# Altium project RFID.PrjPcb
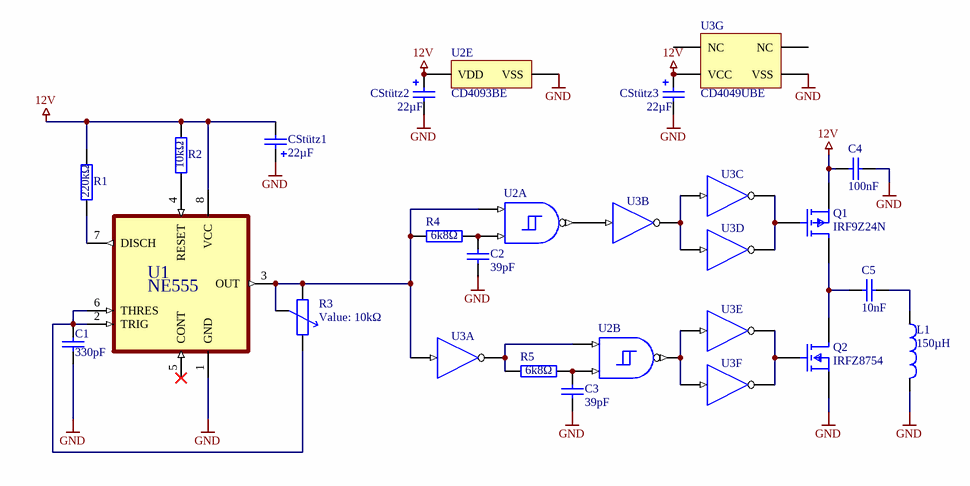
[diagram p0: Lesegerät.SchDoc]
10 sheets, 213 parts. Net scope: flat (ports and power ports of the same name join across sheets).
Sheets:
  Lesegerät.SchDoc
  Lesegerät_RC-Ozillator.SchDoc
  Lesegerät_SigA_MosT_GegE.SchDoc
  Tag.SchDoc
  Lesegerät_Lastmodulation_Sekundär.SchDoc
  Tag_Lastmodulation_Sekundär.SchDoc
  Lesegerät_Lastmodulation_Primär.SchDoc
  Tag_Lastmodulation_Primär.SchDoc
  Lesegerät_Lastmodulation_ESP32.SchDoc
  Tag_Lastmodulation_ESP32.SchDoc

## Sheet Lesegerät.SchDoc
size A4; SheetNumber: 1; SheetTotal: 9; PageSetup: Record=PageOptions|CenterHorizontal=True|CenterVertical=True|PrintScale=0.97|XCorrection=1.00|YCorrection=1.00|PrintKind=2|BorderSize=5000000|LeftOffset=0|BottomOffset=0|Orientation=2|PaperLength=1000|PaperWidth=1000|Scale=100|PaperSource=7|PrintQuality=-3|MediaType=1|DitherType=10|PrintScaleMode=1|PaperKind=A4|PaperIndex=9

### Parts
(Parts that share a designator on the sheet are numbered #1, #2 ... from top to bottom, then left to right.)
C1#1  330pF  [rad-7.2/2.5/5]
C2#1  value 39pF  [rad-7.2/2.5/5]  (hidden comment: KO)
C3#1  value 39pF  [rad-7.2/2.5/5]  (hidden comment: KO)
C4#1  value 100nF  [rad-7.2/2.5/5]  (hidden comment: KO)
C5#1  value 10nF  [rad-7.2/2.5/5]  (hidden comment: KO)
CStütz1#1  value 22µF  [RB-.1/.2]  (hidden comment: ELKO)
CStütz2#1  value 22µF  [RB-.1/.2]  (hidden comment: ELKO)
CStütz3#1  value 22µF  [RB-.1/.2]  (hidden comment: ELKO)
L1#1  value 150µH  (hidden comment: Inductor)
Q1#1  IRF9Z24N  [FP-PG-SOT323-3-IPC_A]
Q2#1  IRFZ8754  [FP-SOT23-IPC_A]
R1#1  value 220kΩ  [Axial-0.4]  (hidden comment: RES)
R2#1  value 10kΩ  [Axial-0.4]  (hidden comment: RES)
R3#1  value 10kΩ  [PT15]  (hidden comment: POT)
R4#1  value 6k8Ω  [Axial-0.4]  (hidden comment: RES)
R5#1  value 6k8Ω  [Axial-0.4]  (hidden comment: RES)
U1#1  NE555  [DIP794W45P254L959H508Q8]
U2#1  CD4093BE  [N0014A]  (value not drawn)  (parts A,B,E of 5)
U3#1  CD4049UBE  [N0016A]  (value not drawn)  (parts A,B,C,D,E,F,G of 7)

### Nets
12V: C4#1.1 CStütz1#1.2 CStütz2#1.1 CStütz3#1.1 Q1#1.2(S) R1#1.2 R2#1.2 U1#1.8(VCC) U2#1.14(VDD) U3#1.1(VCC)
GND: C1#1.2 C2#1.2 C3#1.2 C4#1.2 CStütz1#1.1 CStütz2#1.2 CStütz3#1.2 L1#1.2 Q2#1.2(S) U1#1.1(GND) U2#1.7(VSS) U3#1.8(VSS)
NetC1#1_1: C1#1.1 R3#1.2 U1#1.2(TRIG) U1#1.6(THRES)
NetC2#1_1: C2#1.1 R4#1.2 U2#1.2(B)
NetC3#1_1: C3#1.1 R5#1.2 U2#1.6(D)
NetC5#1_1: C5#1.1 Q1#1.3(D) Q2#1.3(D)
NetC5#1_2: C5#1.2 L1#1.1
NetQ1#1_G2: Q1#1.G2(G) U3#1.6(I=~{C}) U3#1.10(J=~{D})
NetQ2#1_G1: Q2#1.G1(G) U3#1.12(K=~{E}) U3#1.15(L=~{F})
NetR1#1_1: R1#1.1 U1#1.7(DISCH)
NetR2#1_1: R2#1.1 U1#1.4(RESET)
NetR3#1_1: R3#1.1 R3#1.3 R4#1.1 U1#1.3(OUT) U2#1.1(A) U3#1.3(A)
NetR5#1_1: R5#1.1 U2#1.5(C) U3#1.2(G=~{A})
NetU2#1_3: U2#1.3(J) U3#1.5(B)
NetU2#1_4: U2#1.4(K) U3#1.11(E) U3#1.14(F)
NetU3#1_4: U3#1.4(H=~{B}) U3#1.7(C) U3#1.9(D)

Not connected (* = marked no-connect by the designer): U1#1 5(CONT)*; U3#1 13(NC) 16(NC)

### Library data of the parts
C1#1 C2#1 C3#1 C4#1 C5#1 = KO: Kondensator
L1#1 = Inductor: SimulationGenericComponent: True
Q1#1 = CMP-32901-000121-1: MOSFET P-CH 60V 150MA SOT-323; Manufacturer: Infineon; Manufacturer Part Number: BSS84PWH6327XTSA1; Automotive Grade: Grade 0; Turn On Delay Time: 6.7ns; Input Capacitace At Vds: 15.3pF @ -25V; Continuous Drain Current: -0.15A; Transconductance: 0.16S; Depletion Mode: False; Max Forward Diode Voltage: -1.12V; Number Of P Channels: 1; Reverse Recovery Charge: 11.6nC; Reverse Recovery Time: 23.6ns; Drain To Source Breakdown Voltage: -60V; Typ Forward Diode Voltage: -0.84V; Threshold Vgs Max: -2V; Turn Off Delay Time: 8.6ns; Gate Charge At Vgs: 1nC @ -10V; Power Dissipation: 0.3W; Pulse Drain Current: -0.6A; Max Junction Temp: +150°C; Gate To Source Voltage: 20V; Rthja Max: 420K/W; Drain To Source Resistance: 6.9Ω; Threshold Vgs Min: -1V; Footprint Url: https://www.infineon.com/cms/en/product/packages/PG-SOT323/PG-SOT323-3-2/; ComponentLink2URL: https://www.infineon.com/dgdl/Infineon-BSS84PW-DS-v02_00-EN.pdf?fileId=db3a3043321e49940132482056d32474; Temperature Range Low: -55°C; Temperature: -55°C to +150°C; Octopart: https://octopart.com/bss84pwh6327xtsa1-infineon-22361355; Category: Trans; Height: 1mm; Lead Free: Yes; Ipc Land Pattern Name: SOT65P210X90-3; Automotive: Yes; Number Of Channels: 1; Digikey Description: MOSFET P-CH 60V 150MA SOT-323; ComponentLink2Description: Datasheet; Device Class L2: Transistors; Drain To Source Voltage: -60V; Temperature Range High: +150°C; Device Class L1: Discrete Semiconductors; RoHS: TRUE; Mouser Description: MOSFET P-Ch -60V 150mA SOT-323-3; Device Class L3: MOSFETs; Package: PG-SOT323-3
Q2#1 = CMP-12801-000064-2: MOSFET N-CH 60V .15MA SOT23-3; On-State Resistance: 5R; Continuous Drain Current (ID): 150mA; Threshold Voltage: 3V; Number of Channels: 1; Gate to Source Voltage (Vgs): 20V; Turn-On Delay Time: 10ns; Power Dissipation: 330mW; Element Configuration: Single; Input Capacitance: 60pF; Weight: 0.000282oz; Height: 1mm; Max Operating Temperature: 150°C; Dual Supply Voltage: 60V; Termination: SMD/SMT; Number of Pins: 3; Number of Elements: 1; Mount: Surface Mount; Min Operating Temperature: -55°C; Nominal Vgs: 3V; Width: 1.4mm; Drain to Source Breakdown Voltage: 60V; Turn-Off Delay Time: 10ns; Case/Package: SOT-23; REACH SVHC: No SVHC; Packaging: Tape and Reel; Length: 3.05mm; Max Power Dissipation: 330mW; Rds On Max: 5R; Lead Free: Lead Free; Contact Plating: Tin; Drain to Source Resistance: 5R; Drain to Source Voltage (Vdss): 60V; Package Quantity: 3000; Current Rating: 150mA; Voltage Rating (DC): 60V
R1#1 R2#1 R4#1 R5#1 = RES: Widerstand
R3#1 = POT: Potentiometer; Set Position: 0.5
U1#1 = NE555P: Single Precision Timer; MF: Texas; SnapEDA_Link: https://www.snapeda.com/parts/NE555P/Texas+Instruments/view-part/?ref=snap; Package: PDIP-8 Texas; Value: *; MP: NE555P; Check_prices: https://www.snapeda.com/parts/NE555P/Texas+Instruments/view-part/?ref=eda
U2#1 = CMP-1627-00493-3: CMOS Quad 2-Input NAND Schmitt Triggers, N0014A, TUBE; Manufacturer: Texas Instruments; ICC @ Nom Voltage(Max)(mA): 0.06; VCC(Min)(V): 3; Rating: Catalog; Bits(#): 4; Technology Family: CD4000; Output Drive (IOL/IOH)(Max)(mA): 1.5/-1.5; VCC(Max)(V): 18; Voltage(Nom)(V): 10; Schmitt Trigger: Yes; F @ Nom Voltage(Max)(Mhz): 8; DatasheetVersion: SCHS115D; PackageReference: N0014A; Code_JEDEC: MS-001; Output Type: CMOS; Input Type: CMOS; Generic Part Number: CD4093B; Operating Temperature Range(C): -55 to 125
U3#1 = CMP-1615-00914-2: CMOS Hex Inverting Buffer/Converter, N0016A, TUBE; Manufacturer: Texas Instruments; Rating: Military; Voltage(Nom)(V): 5; VCC(Min)(V): 3; VCC(Max)(V): 18; Output Drive (IOL/IOH)(Max)(mA): -1.2/5.2; ICC @ Nom Voltage(Max)(mA): 0.03; F @ Nom Voltage(Max)(Mhz): 12; tpd @ Nom Voltage(Max)(ns): 120; Technology Family: CD4000; Schmitt Trigger: No; Bits(#): 6; Code_JEDEC: MS-001; DatasheetVersion: SCHS046I; Generic Part Number: CD4049UB; Input Type: CMOS; Output Type: CMOS; PackageReference: N0016A; Operating Temperature Range(C): -55 to 125

## Sheet Lesegerät_RC-Ozillator.SchDoc
size A4; SheetNumber: 2; SheetTotal: 4
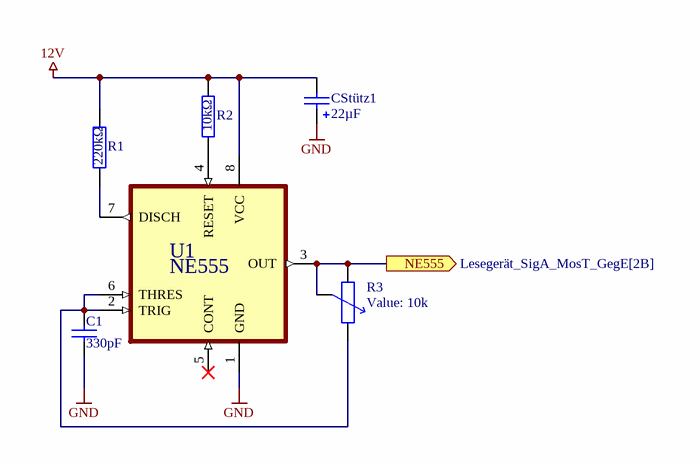
[diagram p1: Lesegerät_RC-Ozillator.SchDoc]

### Parts
(Parts that share a designator on the sheet are numbered #1, #2 ... from top to bottom, then left to right.)
C1#2  330pF  [rad-7.2/2.5/5]
CStütz1#2  value 22µF  [RB-.1/.2]  (hidden comment: ELKO)
R1#2  value 220kΩ  [Axial-0.4]  (hidden comment: RES)
R2#2  value 10kΩ  [Axial-0.4]  (hidden comment: RES)
R3#2  value 10k  [PT15]  (hidden comment: POT)
U1#2  NE555  [DIP794W45P254L959H508Q8]

### Ports
NE555 (out, see Lesegerät_SigA_MosT_GegE[2B])

### Nets
12V: CStütz1#2.2 R1#2.2 R2#2.2 U1#2.8(VCC)
GND: C1#2.2 CStütz1#2.1 U1#2.1(GND)
NetC1#2_1: C1#2.1 R3#2.2 U1#2.2(TRIG) U1#2.6(THRES)
NetR1#2_1: R1#2.1 U1#2.7(DISCH)
NetR2#2_1: R2#2.1 U1#2.4(RESET)
NetR3#2_1: R3#2.1 R3#2.3 U1#2.3(OUT) ; port NE555

Not connected (* = marked no-connect by the designer): U1#2 5(CONT)*

### Library data of the parts
C1#2 = KO: Kondensator
R1#2 R2#2 = RES: Widerstand
R3#2 = POT: Potentiometer; Set Position: 0.5
U1#2 = NE555P: Single Precision Timer; MF: Texas; SnapEDA_Link: https://www.snapeda.com/parts/NE555P/Texas+Instruments/view-part/?ref=snap; Package: PDIP-8 Texas; Value: *; MP: NE555P; Check_prices: https://www.snapeda.com/parts/NE555P/Texas+Instruments/view-part/?ref=eda

## Sheet Lesegerät_SigA_MosT_GegE.SchDoc
size A4; SheetNumber: 3; SheetTotal: 4
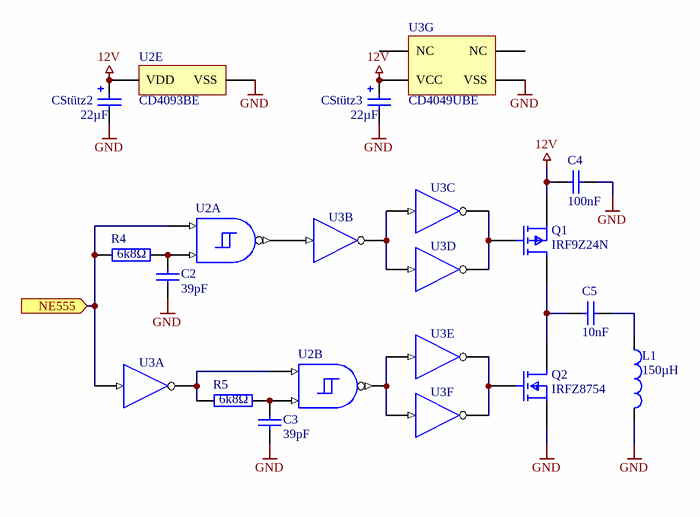
[diagram p2: Lesegerät_SigA_MosT_GegE.SchDoc]

### Parts
(Parts that share a designator on the sheet are numbered #1, #2 ... from top to bottom, then left to right.)
C2#2  value 39pF  [rad-7.2/2.5/5]  (hidden comment: KO)
C3#2  value 39pF  [rad-7.2/2.5/5]  (hidden comment: KO)
C4#2  value 100nF  [rad-7.2/2.5/5]  (hidden comment: KO)
C5#2  value 10nF  [rad-7.2/2.5/5]  (hidden comment: KO)
CStütz2#2  value 22µF  [RB-.1/.2]  (hidden comment: ELKO)
CStütz3#2  value 22µF  [RB-.1/.2]  (hidden comment: ELKO)
L1#2  value 150µH  (hidden comment: Inductor)
Q1#2  IRF9Z24N  [FP-PG-SOT323-3-IPC_A]
Q2#2  IRFZ8754  [FP-SOT23-IPC_A]
R4#2  value 6k8Ω  [Axial-0.4]  (hidden comment: RES)
R5#2  value 6k8Ω  [Axial-0.4]  (hidden comment: RES)
U2#2  CD4093BE  [N0014A]  (value not drawn)  (parts A,B,E of 5)
U3#2  CD4049UBE  [N0016A]  (value not drawn)  (parts A,B,C,D,E,F,G of 7)

### Ports
NE555 (in, see Lesegerät_RC-Ozillator[2B])

### Nets
12V: C4#2.1 CStütz2#2.1 CStütz3#2.1 Q1#2.2(S) U2#2.14(VDD) U3#2.1(VCC)
GND: C2#2.2 C3#2.2 C4#2.2 CStütz2#2.2 CStütz3#2.2 L1#2.2 Q2#2.2(S) U2#2.7(VSS) U3#2.8(VSS)
NetC2#2_1: C2#2.1 R4#2.2 U2#2.2(B)
NetC3#2_1: C3#2.1 R5#2.2 U2#2.6(D)
NetC5#2_1: C5#2.1 Q1#2.3(D) Q2#2.3(D)
NetC5#2_2: C5#2.2 L1#2.1
NetQ1#2_G2: Q1#2.G2(G) U3#2.6(I=~{C}) U3#2.10(J=~{D})
NetQ2#2_G1: Q2#2.G1(G) U3#2.12(K=~{E}) U3#2.15(L=~{F})
NetR3#2_1: R4#2.1 U2#2.1(A) U3#2.3(A) ; port NE555
NetR5#2_1: R5#2.1 U2#2.5(C) U3#2.2(G=~{A})
NetU2#2_3: U2#2.3(J) U3#2.5(B)
NetU2#2_4: U2#2.4(K) U3#2.11(E) U3#2.14(F)
NetU3#2_4: U3#2.4(H=~{B}) U3#2.7(C) U3#2.9(D)

Not connected (* = marked no-connect by the designer): U3#2 13(NC) 16(NC)

### Library data of the parts
C2#2 C3#2 C4#2 C5#2 = KO: Kondensator
L1#2 = Inductor: SimulationGenericComponent: True
Q1#2 = CMP-32901-000121-1: as Q1#1 on sheet Lesegerät; Footprint Url: https://www.infineon.com/cms/en/product/packages/PG-SOT323/PG-SOT323-3-2/; ComponentLink2URL: https://www.infineon.com/dgdl/Infineon-BSS84PW-DS-v02_00-EN.pdf?fileId=db3a3043321e49940132482056d32474; Temperature Range Low: -55°C; Temperature: -55°C to +150°C; Octopart: https://octopart.com/bss84pwh6327xtsa1-infineon-22361355; Category: Trans; Height: 1mm; Lead Free: Yes; Ipc Land Pattern Name: SOT65P210X90-3; Automotive: Yes; Number Of Channels: 1; Digikey Description: MOSFET P-CH 60V 150MA SOT-323; ComponentLink2Description: Datasheet; Device Class L2: Transistors; Drain To Source Voltage: -60V; Temperature Range High: +150°C; Device Class L1: Discrete Semiconductors; RoHS: TRUE; Mouser Description: MOSFET P-Ch -60V 150mA SOT-323-3; Device Class L3: MOSFETs; Package: PG-SOT323-3
Q2#2 = CMP-12801-000064-2: as Q2#1 on sheet Lesegerät; Weight: 0.000282oz; Height: 1mm; Max Operating Temperature: 150°C; Dual Supply Voltage: 60V; Termination: SMD/SMT; Number of Pins: 3; Number of Elements: 1; Mount: Surface Mount; Min Operating Temperature: -55°C; Nominal Vgs: 3V; Width: 1.4mm; Drain to Source Breakdown Voltage: 60V; Turn-Off Delay Time: 10ns; Case/Package: SOT-23; REACH SVHC: No SVHC; Packaging: Tape and Reel; Length: 3.05mm; Max Power Dissipation: 330mW; Rds On Max: 5R; Lead Free: Lead Free; Contact Plating: Tin; Drain to Source Resistance: 5R; Drain to Source Voltage (Vdss): 60V; Package Quantity: 3000; Current Rating: 150mA; Voltage Rating (DC): 60V
R4#2 R5#2 = RES: Widerstand
U2#2 = CMP-1627-00493-3: as U2#1 on sheet Lesegerät; DatasheetVersion: SCHS115D; PackageReference: N0014A; Code_JEDEC: MS-001; Output Type: CMOS; Input Type: CMOS; Generic Part Number: CD4093B; Operating Temperature Range(C): -55 to 125
U3#2 = CMP-1615-00914-2: as U3#1 on sheet Lesegerät; Code_JEDEC: MS-001; DatasheetVersion: SCHS046I; Generic Part Number: CD4049UB; Input Type: CMOS; Output Type: CMOS; PackageReference: N0016A; Operating Temperature Range(C): -55 to 125

## Sheet Tag.SchDoc
size A4; SheetNumber: 4; SheetTotal: 4
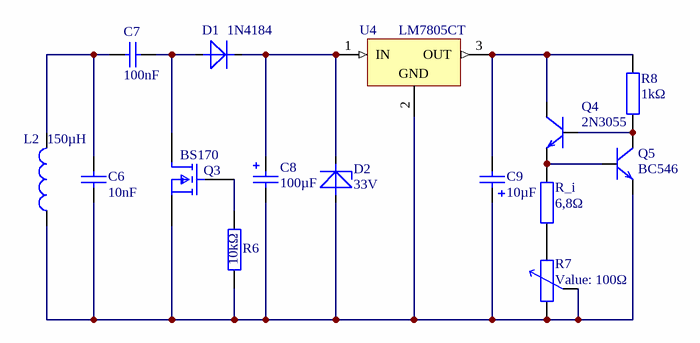
[diagram p3: Tag.SchDoc]

### Parts
(Parts that share a designator on the sheet are numbered #1, #2 ... from top to bottom, then left to right.)
C6#1  value 10nF  [rad-7.2/2.5/5]  (hidden comment: KO)
C7#1  value 100nF  [rad-7.2/2.5/5]  (hidden comment: KO)
C8#1  value 100µF  [RB-.1/.2]  (hidden comment: ELKO)
C9#1  value 10µF  [RB-.1/.2]  (hidden comment: ELKO)
D1#1  1N4184  [DIODE-0.6]
D2#1  33V  [DIODE-0.4]
L2#1  value 150µH  (hidden comment: Inductor)
Q3#1  BS170  [FP-SOT23-IPC_A]
Q4#1  2N3055  [TO-92/EBC]
Q5#1  BC546  [TO-92/EBC]
R6#1  value 10kΩ  [Axial-0.4]  (hidden comment: RES)
R7#1  value 100Ω  [PT15]  (hidden comment: POT)
R8#1  value 1kΩ  [Axial-0.4]  (hidden comment: RES)
R_i  value 6,8Ω  [Axial-0.4]  (hidden comment: RES)
U4#1  LM7805CT  [FAIR-TO-220-3]

### Nets
NetC6#1_1: C6#1.1 C8#1.2 C9#1.1 D2#1.1(A) L2#1.2 Q3#1.2(S) Q5#1.2(E) R6#1.1 R7#1.1 R7#1.3 U4#1.2(GND)
NetC6#1_2: C6#1.2 C7#1.2 L2#1.1
NetC7#1_1: C7#1.1 D1#1.1(A) Q3#1.3(D)
NetC8#1_1: C8#1.1 D1#1.2(K) D2#1.2(K) U4#1.1(IN)
NetC9#1_2: C9#1.2 Q4#1.3(C) R8#1.2 U4#1.3(OUT)
NetQ3#1_G1: Q3#1.G1(G) R6#1.2
NetQ4#1_1: Q4#1.1(B) Q5#1.3(C) R8#1.1
NetQ4#1_2: Q4#1.2(E) Q5#1.1(B) R_i.2
NetR7#1_2: R7#1.2 R_i.1

### Library data of the parts
C6#1 C7#1 = KO: Kondensator
D1#1 = DIODE
D2#1 = Z-DIODE
L2#1 = Inductor: SimulationGenericComponent: True
Q3#1 = CMP-12801-000064-2: as Q2#1 on sheet Lesegerät; Weight: 0.000282oz; Height: 1mm; Max Operating Temperature: 150°C; Dual Supply Voltage: 60V; Termination: SMD/SMT; Number of Pins: 3; Number of Elements: 1; Mount: Surface Mount; Min Operating Temperature: -55°C; Nominal Vgs: 3V; Width: 1.4mm; Drain to Source Breakdown Voltage: 60V; Turn-Off Delay Time: 10ns; Case/Package: SOT-23; REACH SVHC: No SVHC; Packaging: Tape and Reel; Length: 3.05mm; Max Power Dissipation: 330mW; Rds On Max: 5R; Lead Free: Lead Free; Contact Plating: Tin; Drain to Source Resistance: 5R; Drain to Source Voltage (Vdss): 60V; Package Quantity: 3000; Current Rating: 150mA; Voltage Rating (DC): 60V
Q4#1 Q5#1 = NPN: Transistor
R6#1 R8#1 R_i = RES: Widerstand
R7#1 = POT: Potentiometer; Set Position: 0.5
U4#1 = CMP-2000-04938-1: Positive Voltage Regulator, 5 V, 1 A, -40 to 125 degC, 3-Pin TO-220, RoHS, Tube; Manufacturer: FairchildSemiconductor; Maximum Input Voltage: 35V; Maximum Quiescent Current: 8mA; Load Regulation: 100mV; Maximum Output Current: 2.2(Typ)A; Output Type: Fixed; Typical Dropout Voltage @ Current: 2@1AV; Rad Hard: No; Output Voltage: 5V; Accuracy: ±4%; Number of Outputs: 1; Category: LinearRegulator; Package Description: 3-Pin Through Hole Device, Body 10 x 4.5 mm, Pitch 2.54 mm; Packaging: Rail/Tube; Mounting: ThroughHole; Polarity: Positive; Manufacturer URL: https://www.fairchildsemi.com/; Line Regulation: 100mV; Datasheet Version: Aug-12; Datasheet URL: https://datasheet.ciiva.com/26904/lm7805ct-26904988.pdf; Package Reference: TO-220; Package URL: https://www.fairchildsemi.com/package-drawings/TO/TO220B03.pdf; Package: 3TO-220AB; Operating Temperature: -40to125degC; Type: Linear

## Sheet Lesegerät_Lastmodulation_Sekundär.SchDoc
size A4; SheetNumber: 5; SheetTotal: 6
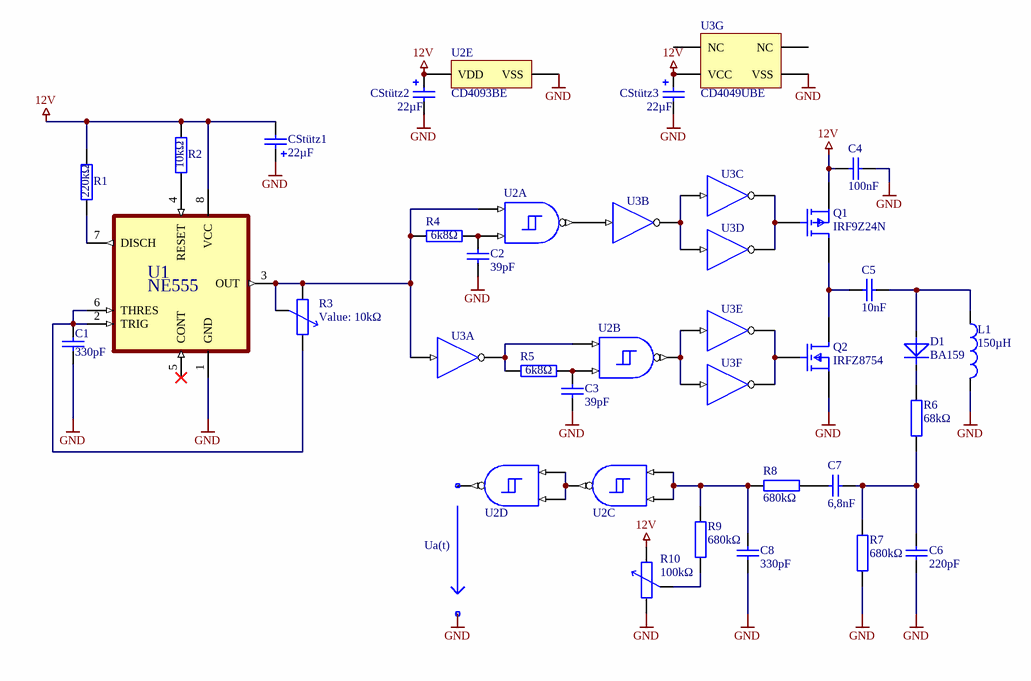
[diagram p4: Lesegerät_Lastmodulation_Sekundär.SchDoc]

### Parts
(Parts that share a designator on the sheet are numbered #1, #2 ... from top to bottom, then left to right.)
*#1  Ua(t)
C1#3  330pF  [rad-7.2/2.5/5]
C2#3  value 39pF  [rad-7.2/2.5/5]  (hidden comment: KO)
C3#3  value 39pF  [rad-7.2/2.5/5]  (hidden comment: KO)
C4#3  value 100nF  [rad-7.2/2.5/5]  (hidden comment: KO)
C5#3  value 10nF  [rad-7.2/2.5/5]  (hidden comment: KO)
C6#2  value 220pF  [rad-7.2/2.5/5]  (hidden comment: KO)
C7#2  value 6,8nF  [rad-7.2/2.5/5]  (hidden comment: KO)
C8#2  value 330pF  [rad-7.2/2.5/5]  (hidden comment: KO)
CStütz1#3  value 22µF  [RB-.1/.2]  (hidden comment: ELKO)
CStütz2#3  value 22µF  [RB-.1/.2]  (hidden comment: ELKO)
CStütz3#3  value 22µF  [RB-.1/.2]  (hidden comment: ELKO)
D1#2  BA159  [DIODE-0.6]
L1#3  value 150µH  (hidden comment: Inductor)
Q1#3  IRF9Z24N  [FP-PG-SOT323-3-IPC_A]
Q2#3  IRFZ8754  [FP-SOT23-IPC_A]
R1#3  value 220kΩ  [Axial-0.4]  (hidden comment: RES)
R2#3  value 10kΩ  [Axial-0.4]  (hidden comment: RES)
R3#3  value 10kΩ  [PT15]  (hidden comment: POT)
R4#3  value 6k8Ω  [Axial-0.4]  (hidden comment: RES)
R5#3  value 6k8Ω  [Axial-0.4]  (hidden comment: RES)
R6#2  value 68kΩ  [Axial-0.4]  (hidden comment: RES)
R7#2  value 680kΩ  [Axial-0.4]  (hidden comment: RES)
R8#2  value 680kΩ  [Axial-0.4]  (hidden comment: RES)
R9#1  value 680kΩ  [Axial-0.4]  (hidden comment: RES)
R10#1  value 100kΩ  [PT15]  (hidden comment: POT)
U1#3  NE555  [DIP794W45P254L959H508Q8]
U2#1  CD4093BE  [N0014A]  (value not drawn)  (parts C,D of 5)
U2#3  CD4093BE  [N0014A]  (value not drawn)  (parts A,B,E of 5)
U3#3  CD4049UBE  [N0016A]  (value not drawn)  (parts A,B,C,D,E,F,G of 7)

### Nets
12V: C4#3.1 CStütz1#3.2 CStütz2#3.1 CStütz3#3.1 Q1#3.2(S) R1#3.2 R2#3.2 R10#1.2 U1#3.8(VCC) U2#3.14(VDD) U3#3.1(VCC)
GND: C1#3.2 C2#3.2 C3#3.2 C4#3.2 C6#2.2 C8#2.2 CStütz1#3.1 CStütz2#3.2 CStütz3#3.2 L1#3.2 Q2#3.2(S) R7#2.1 R10#1.1 U1#3.1(GND) U2#3.7(VSS) U3#3.8(VSS)
NetC1#3_1: C1#3.1 R3#3.2 U1#3.2(TRIG) U1#3.6(THRES)
NetC2#3_1: C2#3.1 R4#3.2 U2#3.2(B)
NetC3#3_1: C3#3.1 R5#3.2 U2#3.6(D)
NetC5#3_1: C5#3.1 Q1#3.3(D) Q2#3.3(D)
NetC5#3_2: C5#3.2 D1#2.1(A) L1#3.1
NetC6#2_1: C6#2.1 C7#2.2 R6#2.1 R7#2.2
NetC7#2_1: C7#2.1 R8#2.1
NetC8#2_1: C8#2.1 R8#2.2 R9#1.1 U2#1.8(E) U2#1.9(F)
NetD1#2_2: D1#2.2(K) R6#2.2
NetQ1#3_G2: Q1#3.G2(G) U3#3.6(I=~{C}) U3#3.10(J=~{D})
NetQ2#3_G1: Q2#3.G1(G) U3#3.12(K=~{E}) U3#3.15(L=~{F})
NetR1#3_1: R1#3.1 U1#3.7(DISCH)
NetR2#3_1: R2#3.1 U1#3.4(RESET)
NetR3#3_1: R3#3.1 R3#3.3 R4#3.1 U1#3.3(OUT) U2#3.1(A) U3#3.3(A)
NetR5#3_1: R5#3.1 U2#3.5(C) U3#3.2(G=~{A})
NetR9#1_2: R9#1.2 R10#1.3
NetU2#1_10: U2#1.10(L) U2#1.12(G) U2#1.13(H)
NetU2#3_3: U2#3.3(J) U3#3.5(B)
NetU2#3_4: U2#3.4(K) U3#3.11(E) U3#3.14(F)
NetU3#3_4: U3#3.4(H=~{B}) U3#3.7(C) U3#3.9(D)

Not connected (* = marked no-connect by the designer): U1#3 5(CONT)*; U2#1 11(M); U3#3 13(NC) 16(NC)

### Notes on the sheet
- Labels drawn without touching a wire or pin: GND

### Library data of the parts
*#1 = Spannungspfeil
C1#3 C2#3 C3#3 C4#3 C5#3 C6#2 C7#2 C8#2 = KO: Kondensator
D1#2 = DIODE
L1#3 = Inductor: SimulationGenericComponent: True
Q1#3 = CMP-32901-000121-1: as Q1#1 on sheet Lesegerät; Footprint Url: https://www.infineon.com/cms/en/product/packages/PG-SOT323/PG-SOT323-3-2/; ComponentLink2URL: https://www.infineon.com/dgdl/Infineon-BSS84PW-DS-v02_00-EN.pdf?fileId=db3a3043321e49940132482056d32474; Temperature Range Low: -55°C; Temperature: -55°C to +150°C; Octopart: https://octopart.com/bss84pwh6327xtsa1-infineon-22361355; Category: Trans; Height: 1mm; Lead Free: Yes; Ipc Land Pattern Name: SOT65P210X90-3; Automotive: Yes; Number Of Channels: 1; Digikey Description: MOSFET P-CH 60V 150MA SOT-323; ComponentLink2Description: Datasheet; Device Class L2: Transistors; Drain To Source Voltage: -60V; Temperature Range High: +150°C; Device Class L1: Discrete Semiconductors; RoHS: TRUE; Mouser Description: MOSFET P-Ch -60V 150mA SOT-323-3; Device Class L3: MOSFETs; Package: PG-SOT323-3
Q2#3 = CMP-12801-000064-2: as Q2#1 on sheet Lesegerät; Weight: 0.000282oz; Height: 1mm; Max Operating Temperature: 150°C; Dual Supply Voltage: 60V; Termination: SMD/SMT; Number of Pins: 3; Number of Elements: 1; Mount: Surface Mount; Min Operating Temperature: -55°C; Nominal Vgs: 3V; Width: 1.4mm; Drain to Source Breakdown Voltage: 60V; Turn-Off Delay Time: 10ns; Case/Package: SOT-23; REACH SVHC: No SVHC; Packaging: Tape and Reel; Length: 3.05mm; Max Power Dissipation: 330mW; Rds On Max: 5R; Lead Free: Lead Free; Contact Plating: Tin; Drain to Source Resistance: 5R; Drain to Source Voltage (Vdss): 60V; Package Quantity: 3000; Current Rating: 150mA; Voltage Rating (DC): 60V
R1#3 R2#3 R4#3 R5#3 R6#2 R7#2 R8#2 R9#1 = RES: Widerstand
R3#3 R10#1 = POT: Potentiometer; Set Position: 0.5
U1#3 = NE555P: Single Precision Timer; MF: Texas; SnapEDA_Link: https://www.snapeda.com/parts/NE555P/Texas+Instruments/view-part/?ref=snap; Package: PDIP-8 Texas; Value: *; MP: NE555P; Check_prices: https://www.snapeda.com/parts/NE555P/Texas+Instruments/view-part/?ref=eda
U2#1 U2#3 = CMP-1627-00493-3: as U2#1 on sheet Lesegerät; DatasheetVersion: SCHS115D; PackageReference: N0014A; Code_JEDEC: MS-001; Output Type: CMOS; Input Type: CMOS; Generic Part Number: CD4093B; Operating Temperature Range(C): -55 to 125
U3#3 = CMP-1615-00914-2: as U3#1 on sheet Lesegerät; Code_JEDEC: MS-001; DatasheetVersion: SCHS046I; Generic Part Number: CD4049UB; Input Type: CMOS; Output Type: CMOS; PackageReference: N0016A; Operating Temperature Range(C): -55 to 125

## Sheet Tag_Lastmodulation_Sekundär.SchDoc
size A4; SheetNumber: 6; SheetTotal: 6
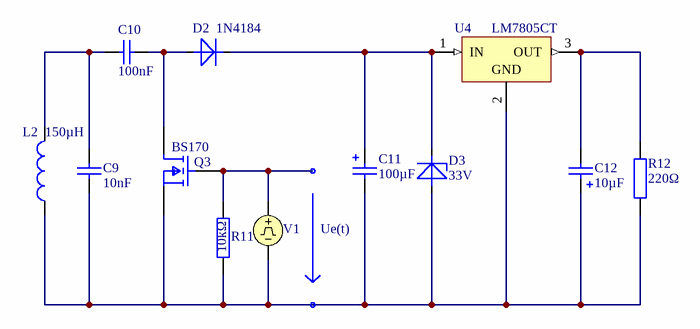
[diagram p5: Tag_Lastmodulation_Sekundär.SchDoc]

### Parts
(Parts that share a designator on the sheet are numbered #1, #2 ... from top to bottom, then left to right.)
*#2  Ue(t)
C9#2  value 10nF  [rad-7.2/2.5/5]  (hidden comment: KO)
C10#1  value 100nF  [rad-7.2/2.5/5]  (hidden comment: KO)
C11#1  value 100µF  [RB-.1/.2]  (hidden comment: ELKO)
C12#1  value 10µF  [RB-.1/.2]  (hidden comment: ELKO)
D2#2  1N4184  [DIODE-0.6]
D3#1  33V  [DIODE-0.4]
L2#2  value 150µH  (hidden comment: Inductor)
Q3#2  BS170  [FP-SOT23-IPC_A]
R11#1  value 10kΩ  [Axial-0.4]  (hidden comment: RES)
R12#1  value 220Ω  [Axial-0.4]  (hidden comment: RES)
U4#2  LM7805CT  [FAIR-TO-220-3]
V1#1  PULSE(0 5 0 4u 1u 0 5u)  (value not drawn)

### Nets
NetC9#2_1: C9#2.1 C11#1.2 C12#1.1 D3#1.1(A) L2#2.2 Q3#2.2(S) R11#1.1 R12#1.1 U4#2.2(GND) V1#1.2
NetC9#2_2: C9#2.2 C10#1.2 L2#2.1
NetC10#1_1: C10#1.1 D2#2.1(A) Q3#2.3(D)
NetC11#1_1: C11#1.1 D2#2.2(K) D3#1.2(K) U4#2.1(IN)
NetC12#1_2: C12#1.2 R12#1.2 U4#2.3(OUT)
NetQ3#2_G1: Q3#2.G1(G) R11#1.2 V1#1.1

### Library data of the parts
*#2 = Spannungspfeil
C9#2 C10#1 = KO: Kondensator
D2#2 = DIODE
D3#1 = Z-DIODE
L2#2 = Inductor: SimulationGenericComponent: True
Q3#2 = CMP-12801-000064-2: as Q2#1 on sheet Lesegerät; Weight: 0.000282oz; Height: 1mm; Max Operating Temperature: 150°C; Dual Supply Voltage: 60V; Termination: SMD/SMT; Number of Pins: 3; Number of Elements: 1; Mount: Surface Mount; Min Operating Temperature: -55°C; Nominal Vgs: 3V; Width: 1.4mm; Drain to Source Breakdown Voltage: 60V; Turn-Off Delay Time: 10ns; Case/Package: SOT-23; REACH SVHC: No SVHC; Packaging: Tape and Reel; Length: 3.05mm; Max Power Dissipation: 330mW; Rds On Max: 5R; Lead Free: Lead Free; Contact Plating: Tin; Drain to Source Resistance: 5R; Drain to Source Voltage (Vdss): 60V; Package Quantity: 3000; Current Rating: 150mA; Voltage Rating (DC): 60V
R11#1 R12#1 = RES: Widerstand
U4#2 = CMP-2000-04938-1: as U4#1 on sheet Tag; Category: LinearRegulator; Package Description: 3-Pin Through Hole Device, Body 10 x 4.5 mm, Pitch 2.54 mm; Packaging: Rail/Tube; Mounting: ThroughHole; Polarity: Positive; Manufacturer URL: https://www.fairchildsemi.com/; Line Regulation: 100mV; Datasheet Version: Aug-12; Datasheet URL: https://datasheet.ciiva.com/26904/lm7805ct-26904988.pdf; Package Reference: TO-220; Package URL: https://www.fairchildsemi.com/package-drawings/TO/TO220B03.pdf; Package: 3TO-220AB; Operating Temperature: -40to125degC; Type: Linear
V1#1 = VPULSE: Pulse Voltage Source; Note: PCB Footprint - Not required; Initial Value: 0; Pulsed Value: 5; AC Magnitude: 1; Published: 8-Jun-2000; LatestRevisionDate: 15-Nov-2004; LatestRevisionNote: Corrected Netlist.; PackageReference: Not Applicable; Publisher: Altium Limited; Rise Time: 4u; Fall Time: 1u; Pulse Width: 0; Period: 5u; DC Magnitude: 0; AC Phase: 0

## Sheet Lesegerät_Lastmodulation_Primär.SchDoc
size A4; SheetNumber: 7; SheetTotal: 7
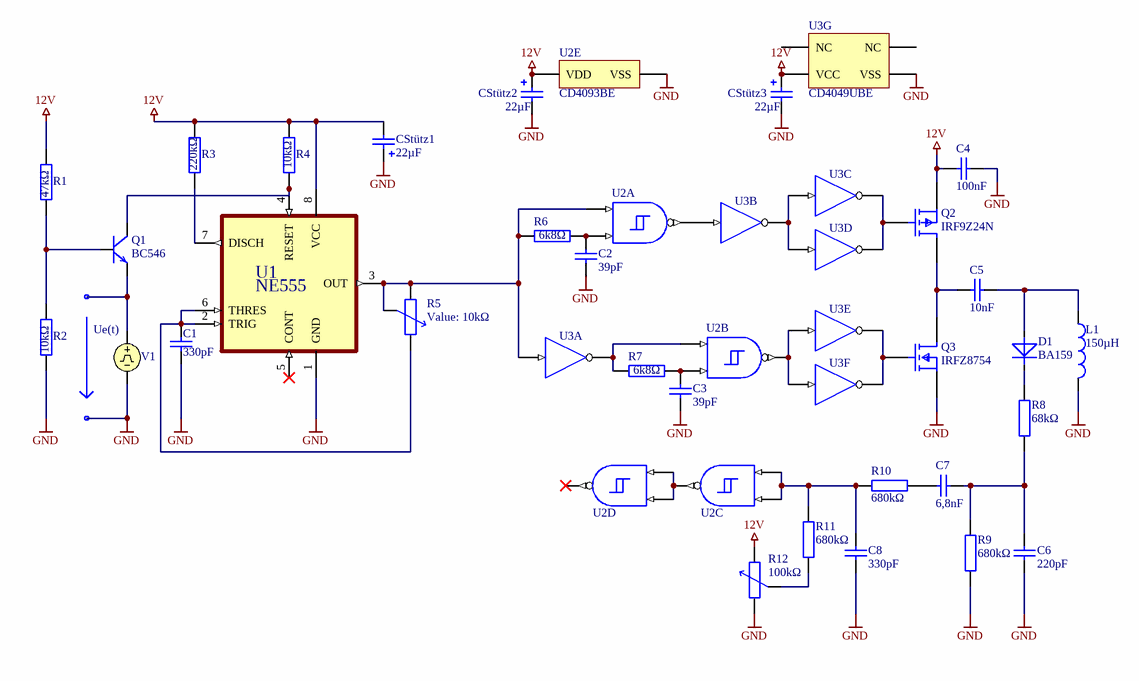
[diagram p6: Lesegerät_Lastmodulation_Primär.SchDoc]

### Parts
(Parts that share a designator on the sheet are numbered #1, #2 ... from top to bottom, then left to right.)
*?  Ue(t)
C1#4  330pF  [rad-7.2/2.5/5]
C2#4  value 39pF  [rad-7.2/2.5/5]  (hidden comment: KO)
C3#4  value 39pF  [rad-7.2/2.5/5]  (hidden comment: KO)
C4#4  value 100nF  [rad-7.2/2.5/5]  (hidden comment: KO)
C5#4  value 10nF  [rad-7.2/2.5/5]  (hidden comment: KO)
C6#3  value 220pF  [rad-7.2/2.5/5]  (hidden comment: KO)
C7#3  value 6,8nF  [rad-7.2/2.5/5]  (hidden comment: KO)
C8#3  value 330pF  [rad-7.2/2.5/5]  (hidden comment: KO)
CStütz1#4  value 22µF  [RB-.1/.2]  (hidden comment: ELKO)
CStütz2#4  value 22µF  [RB-.1/.2]  (hidden comment: ELKO)
CStütz3#4  value 22µF  [RB-.1/.2]  (hidden comment: ELKO)
D1#3  BA159  [DIODE-0.6]
L1#4  value 150µH  (hidden comment: Inductor)
Q1#4  BC546  [TO-92/EBC]
Q2#4  IRF9Z24N  [FP-PG-SOT323-3-IPC_A]
Q3#3  IRFZ8754  [FP-SOT23-IPC_A]
R1#4  value 47kΩ  [Axial-0.4]  (hidden comment: RES)
R2#4  value 10kΩ  [Axial-0.4]  (hidden comment: RES)
R3#4  value 220kΩ  [Axial-0.4]  (hidden comment: RES)
R4#4  value 10kΩ  [Axial-0.4]  (hidden comment: RES)
R5#4  value 10kΩ  [PT15]  (hidden comment: POT)
R6#3  value 6k8Ω  [Axial-0.4]  (hidden comment: RES)
R7#3  value 6k8Ω  [Axial-0.4]  (hidden comment: RES)
R8#3  value 68kΩ  [Axial-0.4]  (hidden comment: RES)
R9#2  value 680kΩ  [Axial-0.4]  (hidden comment: RES)
R10#2  value 680kΩ  [Axial-0.4]  (hidden comment: RES)
R11#2  value 680kΩ  [Axial-0.4]  (hidden comment: RES)
R12#2  value 100kΩ  [PT15]  (hidden comment: POT)
U1#4  NE555  [DIP794W45P254L959H508Q8]
U2#2  CD4093BE  [N0014A]  (value not drawn)  (parts C,D of 5)
U2#4  CD4093BE  [N0014A]  (value not drawn)  (parts A,B,E of 5)
U3#4  CD4049UBE  [N0016A]  (value not drawn)  (parts A,B,C,D,E,F,G of 7)
V1#2  PULSE(0 5 0 4u 1u 0 5u)  (value not drawn)

### Nets
12V: C4#4.1 CStütz1#4.2 CStütz2#4.1 CStütz3#4.1 Q2#4.2(S) R1#4.2 R3#4.2 R4#4.2 R12#2.2 U1#4.8(VCC) U2#4.14(VDD) U3#4.1(VCC)
GND: C1#4.2 C2#4.2 C3#4.2 C4#4.2 C6#3.2 C8#3.2 CStütz1#4.1 CStütz2#4.2 CStütz3#4.2 L1#4.2 Q3#3.2(S) R2#4.1 R9#2.1 R12#2.1 U1#4.1(GND) U2#4.7(VSS) U3#4.8(VSS) V1#2.2
NetC1#4_1: C1#4.1 R5#4.2 U1#4.2(TRIG) U1#4.6(THRES)
NetC2#4_1: C2#4.1 R6#3.2 U2#4.2(B)
NetC3#4_1: C3#4.1 R7#3.2 U2#4.6(D)
NetC5#4_1: C5#4.1 Q2#4.3(D) Q3#3.3(D)
NetC5#4_2: C5#4.2 D1#3.1(A) L1#4.1
NetC6#3_1: C6#3.1 C7#3.2 R8#3.1 R9#2.2
NetC7#3_1: C7#3.1 R10#2.1
NetC8#3_1: C8#3.1 R10#2.2 R11#2.1 U2#2.8(E) U2#2.9(F)
NetD1#3_2: D1#3.2(K) R8#3.2
NetQ1#4_1: Q1#4.1(B) R1#4.1 R2#4.2
NetQ1#4_2: Q1#4.2(E) V1#2.1
NetQ1#4_3: Q1#4.3(C) R4#4.1 U1#4.4(RESET)
NetQ2#4_G2: Q2#4.G2(G) U3#4.6(I=~{C}) U3#4.10(J=~{D})
NetQ3#3_G1: Q3#3.G1(G) U3#4.12(K=~{E}) U3#4.15(L=~{F})
NetR3#4_1: R3#4.1 U1#4.7(DISCH)
NetR5#4_1: R5#4.1 R5#4.3 R6#3.1 U1#4.3(OUT) U2#4.1(A) U3#4.3(A)
NetR7#3_1: R7#3.1 U2#4.5(C) U3#4.2(G=~{A})
NetR11#2_2: R11#2.2 R12#2.3
NetU2#2_10: U2#2.10(L) U2#2.12(G) U2#2.13(H)
NetU2#4_3: U2#4.3(J) U3#4.5(B)
NetU2#4_4: U2#4.4(K) U3#4.11(E) U3#4.14(F)
NetU3#4_4: U3#4.4(H=~{B}) U3#4.7(C) U3#4.9(D)

Not connected (* = marked no-connect by the designer): U1#4 5(CONT)*; U2#2 11(M)*; U3#4 13(NC) 16(NC)

### Library data of the parts
*? = Spannungspfeil
C1#4 C2#4 C3#4 C4#4 C5#4 C6#3 C7#3 C8#3 = KO: Kondensator
D1#3 = DIODE
L1#4 = Inductor: SimulationGenericComponent: True
Q1#4 = NPN: Transistor
Q2#4 = CMP-32901-000121-1: as Q1#1 on sheet Lesegerät; Footprint Url: https://www.infineon.com/cms/en/product/packages/PG-SOT323/PG-SOT323-3-2/; ComponentLink2URL: https://www.infineon.com/dgdl/Infineon-BSS84PW-DS-v02_00-EN.pdf?fileId=db3a3043321e49940132482056d32474; Temperature Range Low: -55°C; Temperature: -55°C to +150°C; Octopart: https://octopart.com/bss84pwh6327xtsa1-infineon-22361355; Category: Trans; Height: 1mm; Lead Free: Yes; Ipc Land Pattern Name: SOT65P210X90-3; Automotive: Yes; Number Of Channels: 1; Digikey Description: MOSFET P-CH 60V 150MA SOT-323; ComponentLink2Description: Datasheet; Device Class L2: Transistors; Drain To Source Voltage: -60V; Temperature Range High: +150°C; Device Class L1: Discrete Semiconductors; RoHS: TRUE; Mouser Description: MOSFET P-Ch -60V 150mA SOT-323-3; Device Class L3: MOSFETs; Package: PG-SOT323-3
Q3#3 = CMP-12801-000064-2: as Q2#1 on sheet Lesegerät; Weight: 0.000282oz; Height: 1mm; Max Operating Temperature: 150°C; Dual Supply Voltage: 60V; Termination: SMD/SMT; Number of Pins: 3; Number of Elements: 1; Mount: Surface Mount; Min Operating Temperature: -55°C; Nominal Vgs: 3V; Width: 1.4mm; Drain to Source Breakdown Voltage: 60V; Turn-Off Delay Time: 10ns; Case/Package: SOT-23; REACH SVHC: No SVHC; Packaging: Tape and Reel; Length: 3.05mm; Max Power Dissipation: 330mW; Rds On Max: 5R; Lead Free: Lead Free; Contact Plating: Tin; Drain to Source Resistance: 5R; Drain to Source Voltage (Vdss): 60V; Package Quantity: 3000; Current Rating: 150mA; Voltage Rating (DC): 60V
R1#4 R2#4 R3#4 R4#4 R6#3 R7#3 R8#3 R9#2 R10#2 R11#2 = RES: Widerstand
R5#4 R12#2 = POT: Potentiometer; Set Position: 0.5
U1#4 = NE555P: Single Precision Timer; MF: Texas; SnapEDA_Link: https://www.snapeda.com/parts/NE555P/Texas+Instruments/view-part/?ref=snap; Package: PDIP-8 Texas; Value: *; MP: NE555P; Check_prices: https://www.snapeda.com/parts/NE555P/Texas+Instruments/view-part/?ref=eda
U2#2 U2#4 = CMP-1627-00493-3: as U2#1 on sheet Lesegerät; DatasheetVersion: SCHS115D; PackageReference: N0014A; Code_JEDEC: MS-001; Output Type: CMOS; Input Type: CMOS; Generic Part Number: CD4093B; Operating Temperature Range(C): -55 to 125
U3#4 = CMP-1615-00914-2: as U3#1 on sheet Lesegerät; Code_JEDEC: MS-001; DatasheetVersion: SCHS046I; Generic Part Number: CD4049UB; Input Type: CMOS; Output Type: CMOS; PackageReference: N0016A; Operating Temperature Range(C): -55 to 125
V1#2 = VPULSE: as V1#1 on sheet Tag_Lastmodulation_Sekundär; Published: 8-Jun-2000; LatestRevisionDate: 15-Nov-2004; LatestRevisionNote: Corrected Netlist.; PackageReference: Not Applicable; Publisher: Altium Limited; Rise Time: 4u; Fall Time: 1u; Pulse Width: 0; Period: 5u; DC Magnitude: 0; AC Phase: 0

## Sheet Tag_Lastmodulation_Primär.SchDoc
size A4; SheetNumber: 8; SheetTotal: 8
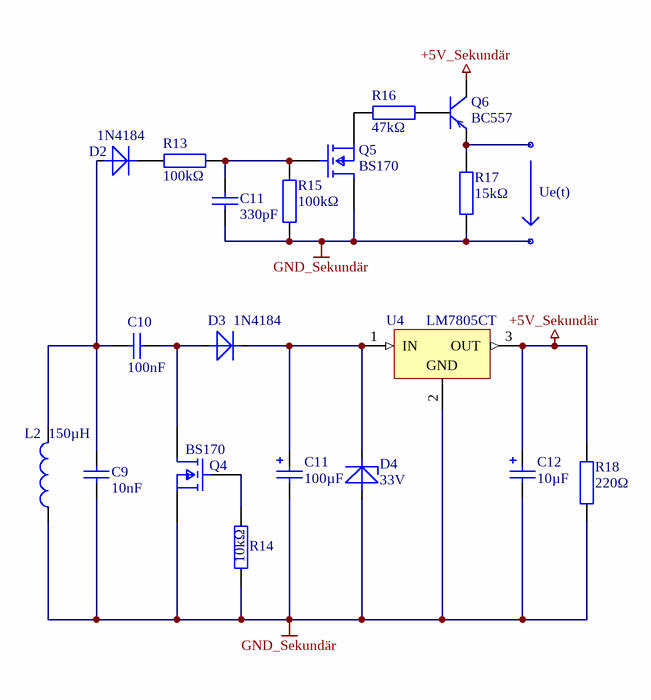
[diagram p7: Tag_Lastmodulation_Primär.SchDoc]

### Parts
(Parts that share a designator on the sheet are numbered #1, #2 ... from top to bottom, then left to right.)
*#3  Ue(t)
C9#3  value 10nF  [rad-7.2/2.5/5]  (hidden comment: KO)
C10#2  value 100nF  [rad-7.2/2.5/5]  (hidden comment: KO)
C11#2  value 330pF  [rad-7.2/2.5/5]  (hidden comment: KO)
C11#3  value 100µF  [RB-.1/.2]  (hidden comment: ELKO)
C12#2  value 10µF  [RB-.1/.2]  (hidden comment: ELKO)
D2#3  1N4184  [DIODE-0.6]
D3#2  1N4184  [DIODE-0.6]
D4#1  33V  [DIODE-0.4]
L2#3  value 150µH  (hidden comment: Inductor)
Q4#2  BS170  [FP-SOT23-IPC_A]
Q5#2  BS170  [FP-SOT23-IPC_A]
Q6#1  BC557  [TO-92/EBC]
R13#1  value 100kΩ  [Axial-0.4]  (hidden comment: RES)
R14#1  value 10kΩ  [Axial-0.4]  (hidden comment: RES)
R15#1  value 100kΩ  [Axial-0.4]  (hidden comment: RES)
R16#1  value 47kΩ  [Axial-0.4]  (hidden comment: RES)
R17#1  value 15kΩ  [Axial-0.4]  (hidden comment: RES)
R18#1  value 220Ω  [Axial-0.4]  (hidden comment: RES)
U4#3  LM7805CT  [FAIR-TO-220-3]

### Nets
+5V_Sekundär: C12#2.1 Q6#1.3(C) R18#1.2 U4#3.3(OUT)
GND_Sekundär: C9#3.1 C11#2.2 C11#3.2 C12#2.2 D4#1.1(A) L2#3.2 Q4#2.2(S) Q5#2.3(D) R14#1.1 R15#1.2 R17#1.2 R18#1.1 U4#3.2(GND)
NetC9#3_2: C9#3.2 C10#2.2 D2#3.1(A) L2#3.1
NetC10#2_1: C10#2.1 D3#2.1(A) Q4#2.3(D)
NetC11#2_1: C11#2.1 Q5#2.G1(G) R13#1.1 R15#1.1
NetC11#3_1: C11#3.1 D3#2.2(K) D4#1.2(K) U4#3.1(IN)
NetD2#3_2: D2#3.2(K) R13#1.2
NetQ4#2_G1: Q4#2.G1(G) R14#1.2
NetQ5#2_2: Q5#2.2(S) R16#1.2
NetQ6#1_1: Q6#1.1(B) R16#1.1
NetQ6#1_2: Q6#1.2(E) R17#1.1

### Library data of the parts
*#3 = Spannungs_kleiner
C9#3 C10#2 C11#2 = KO: Kondensator
D2#3 D3#2 = DIODE
D4#1 = Z-DIODE
L2#3 = Inductor: SimulationGenericComponent: True
Q4#2 Q5#2 = CMP-12801-000064-2: as Q2#1 on sheet Lesegerät; Weight: 0.000282oz; Height: 1mm; Max Operating Temperature: 150°C; Dual Supply Voltage: 60V; Termination: SMD/SMT; Number of Pins: 3; Number of Elements: 1; Mount: Surface Mount; Min Operating Temperature: -55°C; Nominal Vgs: 3V; Width: 1.4mm; Drain to Source Breakdown Voltage: 60V; Turn-Off Delay Time: 10ns; Case/Package: SOT-23; REACH SVHC: No SVHC; Packaging: Tape and Reel; Length: 3.05mm; Max Power Dissipation: 330mW; Rds On Max: 5R; Lead Free: Lead Free; Contact Plating: Tin; Drain to Source Resistance: 5R; Drain to Source Voltage (Vdss): 60V; Package Quantity: 3000; Current Rating: 150mA; Voltage Rating (DC): 60V
Q6#1 = PNP: Transistor
R13#1 R14#1 R15#1 R16#1 R17#1 R18#1 = RES: Widerstand
U4#3 = CMP-2000-04938-1: as U4#1 on sheet Tag; Category: LinearRegulator; Package Description: 3-Pin Through Hole Device, Body 10 x 4.5 mm, Pitch 2.54 mm; Packaging: Rail/Tube; Mounting: ThroughHole; Polarity: Positive; Manufacturer URL: https://www.fairchildsemi.com/; Line Regulation: 100mV; Datasheet Version: Aug-12; Datasheet URL: https://datasheet.ciiva.com/26904/lm7805ct-26904988.pdf; Package Reference: TO-220; Package URL: https://www.fairchildsemi.com/package-drawings/TO/TO220B03.pdf; Package: 3TO-220AB; Operating Temperature: -40to125degC; Type: Linear

## Sheet Lesegerät_Lastmodulation_ESP32.SchDoc
size A4; SheetNumber: 9; SheetTotal: 9
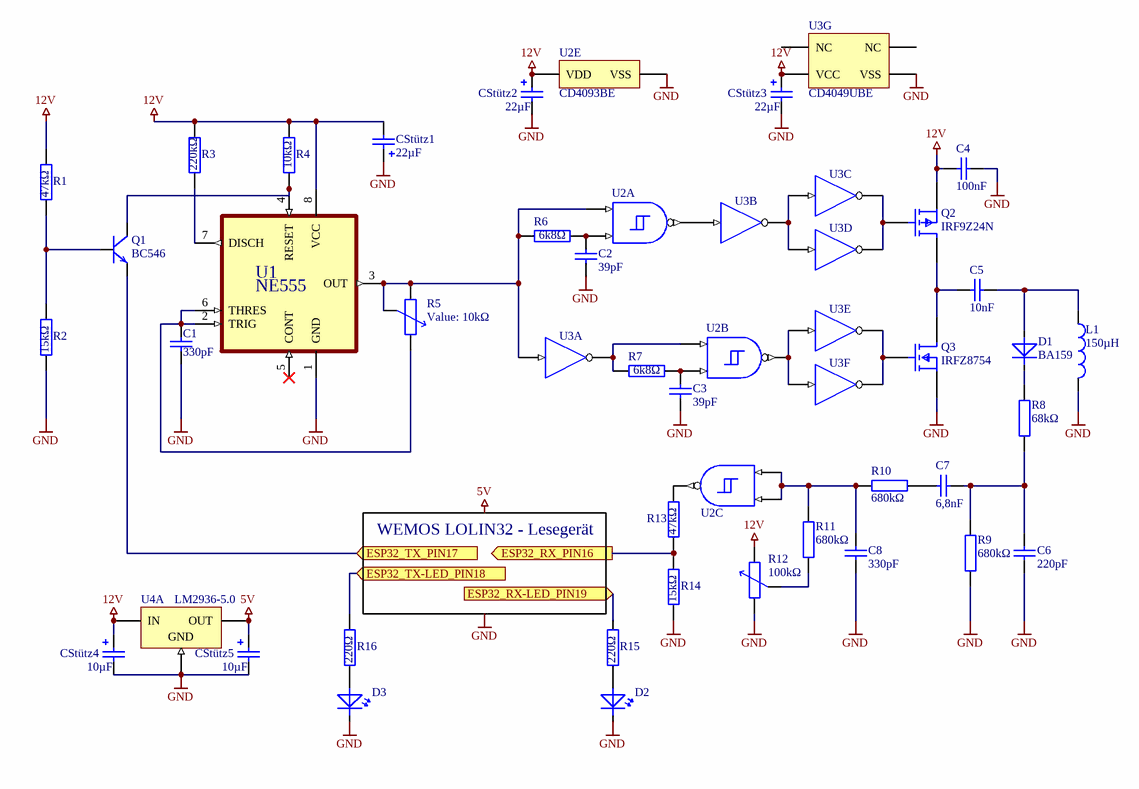
[diagram p8: Lesegerät_Lastmodulation_ESP32.SchDoc]

### Parts
(Parts that share a designator on the sheet are numbered #1, #2 ... from top to bottom, then left to right.)
C1#5  330pF  [rad-7.2/2.5/5]
C2#5  value 39pF  [rad-7.2/2.5/5]  (hidden comment: KO)
C3#5  value 39pF  [rad-7.2/2.5/5]  (hidden comment: KO)
C4#5  value 100nF  [rad-7.2/2.5/5]  (hidden comment: KO)
C5#5  value 10nF  [rad-7.2/2.5/5]  (hidden comment: KO)
C6#4  value 220pF  [rad-7.2/2.5/5]  (hidden comment: KO)
C7#4  value 6,8nF  [rad-7.2/2.5/5]  (hidden comment: KO)
C8#4  value 330pF  [rad-7.2/2.5/5]  (hidden comment: KO)
CStütz1#5  value 22µF  [RB-.1/.2]  (hidden comment: ELKO)
CStütz2#5  value 22µF  [RB-.1/.2]  (hidden comment: ELKO)
CStütz3#5  value 22µF  [RB-.1/.2]  (hidden comment: ELKO)
CStütz4  value 10µF  [RB-.1/.2]  (hidden comment: ELKO)
CStütz5  value 10µF  [RB-.1/.2]  (hidden comment: ELKO)
D1#4  BA159  [DIODE-0.6]
D2#4  LED  [LED-3]  (value not drawn)
D3#3  LED  [LED-3]  (value not drawn)
L1#5  value 150µH  (hidden comment: Inductor)
Q1#5  BC546  [TO-92/EBC]
Q2#5  IRF9Z24N  [FP-PG-SOT323-3-IPC_A]
Q3#4  IRFZ8754  [FP-SOT23-IPC_A]
R1#5  value 47kΩ  [Axial-0.4]  (hidden comment: RES)
R2#5  value 15kΩ  [Axial-0.4]  (hidden comment: RES)
R3#5  value 220kΩ  [Axial-0.4]  (hidden comment: RES)
R4#5  value 10kΩ  [Axial-0.4]  (hidden comment: RES)
R5#5  value 10kΩ  [PT15]  (hidden comment: POT)
R6#4  value 6k8Ω  [Axial-0.4]  (hidden comment: RES)
R7#4  value 6k8Ω  [Axial-0.4]  (hidden comment: RES)
R8#4  value 68kΩ  [Axial-0.4]  (hidden comment: RES)
R9#3  value 680kΩ  [Axial-0.4]  (hidden comment: RES)
R10#3  value 680kΩ  [Axial-0.4]  (hidden comment: RES)
R11#3  value 680kΩ  [Axial-0.4]  (hidden comment: RES)
R12#3  value 100kΩ  [PT15]  (hidden comment: POT)
R13#2  value 47kΩ  [Axial-0.4]  (hidden comment: RES)
R14#2  value 15kΩ  [Axial-0.4]  (hidden comment: RES)
R15#2  value 220Ω  [Axial-0.4]  (hidden comment: RES)
R16#2  value 220Ω  [Axial-0.4]  (hidden comment: RES)
U1#5  NE555  [DIP794W45P254L959H508Q8]
U2#3  CD4093BE  [N0014A]  (value not drawn)  (part C of 5)
U2#5  CD4093BE  [N0014A]  (value not drawn)  (parts A,B,E of 5)
U3#5  CD4049UBE  [N0016A]  (value not drawn)  (parts A,B,C,D,E,F,G of 7)
U4#4  LM2936-5.0  [DGK0008A_M]  (part A of 2)

### Ports
ESP32_RX-LED_PIN19 (in, see Tag_Lastmodulation_ESP32[3C]), ESP32_RX_PIN16 (out, see Tag_Lastmodulation_ESP32[3B]), ESP32_TX-LED_PIN18 (in, see Tag_Lastmodulation_ESP32[3C]), ESP32_TX_PIN17 (in, see Tag_Lastmodulation_ESP32[3B])

### Nets
5V: CStütz5.1 U4#4.1(OUT)
12V: C4#5.1 CStütz1#5.2 CStütz2#5.1 CStütz3#5.1 CStütz4.1 Q2#5.2(S) R1#5.2 R3#5.2 R4#5.2 R12#3.2 U1#5.8(VCC) U2#5.14(VDD) U3#5.1(VCC) U4#4.8(IN)
GND: C1#5.2 C2#5.2 C3#5.2 C4#5.2 C6#4.2 C8#4.2 CStütz1#5.1 CStütz2#5.2 CStütz3#5.2 CStütz4.2 CStütz5.2 D2#4.2(K) D3#3.2(K) L1#5.2 Q3#4.2(S) R2#5.1 R9#3.1 R12#3.1 R14#2.1 U1#5.1(GND) U2#5.7(VSS) U3#5.8(VSS) U4#4.7(ADJ)
NetC1#5_1: C1#5.1 R5#5.2 U1#5.2(TRIG) U1#5.6(THRES)
NetC2#5_1: C2#5.1 R6#4.2 U2#5.2(B)
NetC3#5_1: C3#5.1 R7#4.2 U2#5.6(D)
NetC5#5_1: C5#5.1 Q2#5.3(D) Q3#4.3(D)
NetC5#5_2: C5#5.2 D1#4.1(A) L1#5.1
NetC6#4_1: C6#4.1 C7#4.2 R8#4.1 R9#3.2
NetC7#4_1: C7#4.1 R10#3.1
NetC8#4_1: C8#4.1 R10#3.2 R11#3.1 U2#3.8(E) U2#3.9(F)
NetD1#4_2: D1#4.2(K) R8#4.2
NetD2#4_1: D2#4.1(A) R15#2.1
NetD3#3_1: D3#3.1(A) R16#2.1
NetQ1#5_1: Q1#5.1(B) R1#5.1 R2#5.2
NetQ1#5_2: Q1#5.2(E) ; port ESP32_TX_PIN17
NetQ1#5_3: Q1#5.3(C) R4#5.1 U1#5.4(RESET)
NetQ2#5_G2: Q2#5.G2(G) U3#5.6(I=~{C}) U3#5.10(J=~{D})
NetQ3#4_G1: Q3#4.G1(G) U3#5.12(K=~{E}) U3#5.15(L=~{F})
NetQ6#2_2: R13#2.1 R14#2.2 ; port ESP32_RX_PIN16
NetR3#5_1: R3#5.1 U1#5.7(DISCH)
NetR5#5_1: R5#5.1 R5#5.3 R6#4.1 U1#5.3(OUT) U2#5.1(A) U3#5.3(A)
NetR7#4_1: R7#4.1 U2#5.5(C) U3#5.2(G=~{A})
NetR11#3_2: R11#3.2 R12#3.3
NetR13#2_2: R13#2.2 U2#3.10(L)
NetR15#2_2: R15#2.2 ; port ESP32_RX-LED_PIN19
NetR16#2_2: R16#2.2 ; port ESP32_TX-LED_PIN18
NetU2#5_3: U2#5.3(J) U3#5.5(B)
NetU2#5_4: U2#5.4(K) U3#5.11(E) U3#5.14(F)
NetU3#5_4: U3#5.4(H=~{B}) U3#5.7(C) U3#5.9(D)

Not connected (* = marked no-connect by the designer): U1#5 5(CONT)*; U3#5 13(NC) 16(NC)

### Notes on the sheet
- WEMOS LOLIN32 - Lesegerät
- Labels drawn without touching a wire or pin: 5V, GND
- (in symbol CMP-0062-02278-3, part A) GND

### Library data of the parts
C1#5 C2#5 C3#5 C4#5 C5#5 C6#4 C7#4 C8#4 = KO: Kondensator
D1#4 = DIODE
D2#4 D3#3 = LED: Diode
L1#5 = Inductor: SimulationGenericComponent: True
Q1#5 = NPN: Transistor
Q2#5 = CMP-32901-000121-1: as Q1#1 on sheet Lesegerät; Footprint Url: https://www.infineon.com/cms/en/product/packages/PG-SOT323/PG-SOT323-3-2/; ComponentLink2URL: https://www.infineon.com/dgdl/Infineon-BSS84PW-DS-v02_00-EN.pdf?fileId=db3a3043321e49940132482056d32474; Temperature Range Low: -55°C; Temperature: -55°C to +150°C; Octopart: https://octopart.com/bss84pwh6327xtsa1-infineon-22361355; Category: Trans; Height: 1mm; Lead Free: Yes; Ipc Land Pattern Name: SOT65P210X90-3; Automotive: Yes; Number Of Channels: 1; Digikey Description: MOSFET P-CH 60V 150MA SOT-323; ComponentLink2Description: Datasheet; Device Class L2: Transistors; Drain To Source Voltage: -60V; Temperature Range High: +150°C; Device Class L1: Discrete Semiconductors; RoHS: TRUE; Mouser Description: MOSFET P-Ch -60V 150mA SOT-323-3; Device Class L3: MOSFETs; Package: PG-SOT323-3
Q3#4 = CMP-12801-000064-2: as Q2#1 on sheet Lesegerät; Weight: 0.000282oz; Height: 1mm; Max Operating Temperature: 150°C; Dual Supply Voltage: 60V; Termination: SMD/SMT; Number of Pins: 3; Number of Elements: 1; Mount: Surface Mount; Min Operating Temperature: -55°C; Nominal Vgs: 3V; Width: 1.4mm; Drain to Source Breakdown Voltage: 60V; Turn-Off Delay Time: 10ns; Case/Package: SOT-23; REACH SVHC: No SVHC; Packaging: Tape and Reel; Length: 3.05mm; Max Power Dissipation: 330mW; Rds On Max: 5R; Lead Free: Lead Free; Contact Plating: Tin; Drain to Source Resistance: 5R; Drain to Source Voltage (Vdss): 60V; Package Quantity: 3000; Current Rating: 150mA; Voltage Rating (DC): 60V
R1#5 R2#5 R3#5 R4#5 R6#4 R7#4 R8#4 R9#3 R10#3 R11#3 R13#2 R14#2 R15#2 R16#2 = RES: Widerstand
R5#5 R12#3 = POT: Potentiometer; Set Position: 0.5
U1#5 = NE555P: Single Precision Timer; MF: Texas; SnapEDA_Link: https://www.snapeda.com/parts/NE555P/Texas+Instruments/view-part/?ref=snap; Package: PDIP-8 Texas; Value: *; MP: NE555P; Check_prices: https://www.snapeda.com/parts/NE555P/Texas+Instruments/view-part/?ref=eda
U2#3 U2#5 = CMP-1627-00493-3: as U2#1 on sheet Lesegerät; DatasheetVersion: SCHS115D; PackageReference: N0014A; Code_JEDEC: MS-001; Output Type: CMOS; Input Type: CMOS; Generic Part Number: CD4093B; Operating Temperature Range(C): -55 to 125
U3#5 = CMP-1615-00914-2: as U3#1 on sheet Lesegerät; Code_JEDEC: MS-001; DatasheetVersion: SCHS046I; Generic Part Number: CD4049UB; Input Type: CMOS; Output Type: CMOS; PackageReference: N0016A; Operating Temperature Range(C): -55 to 125
U4#4 = CMP-0062-02278-3: Ultra-Low Quiescent Current LDO Voltage Regulator, 8-pin Mini SOIC; Manufacturer: Texas Instruments; PackageTopMarking: ZXTT*KBA; CompType: LDO IC; PowerWise: N; PackageDescription: MINI SOIC, .118 x .118 x .034in, 8 Lead, .0256in Pitch; ComponentLink1URL: http://www.ti.com/general/docs/lit/getliterature.tsp?genericPartNumber=LM2936&fileType=pdf; RoHS: N; ComponentLink1Description: Datasheet URL; Code_JEDEC: MO-187-AA; PinCount: 8; PackageReference: DGK0008A

## Sheet Tag_Lastmodulation_ESP32.SchDoc
size A4; SheetNumber: 10; SheetTotal: 10
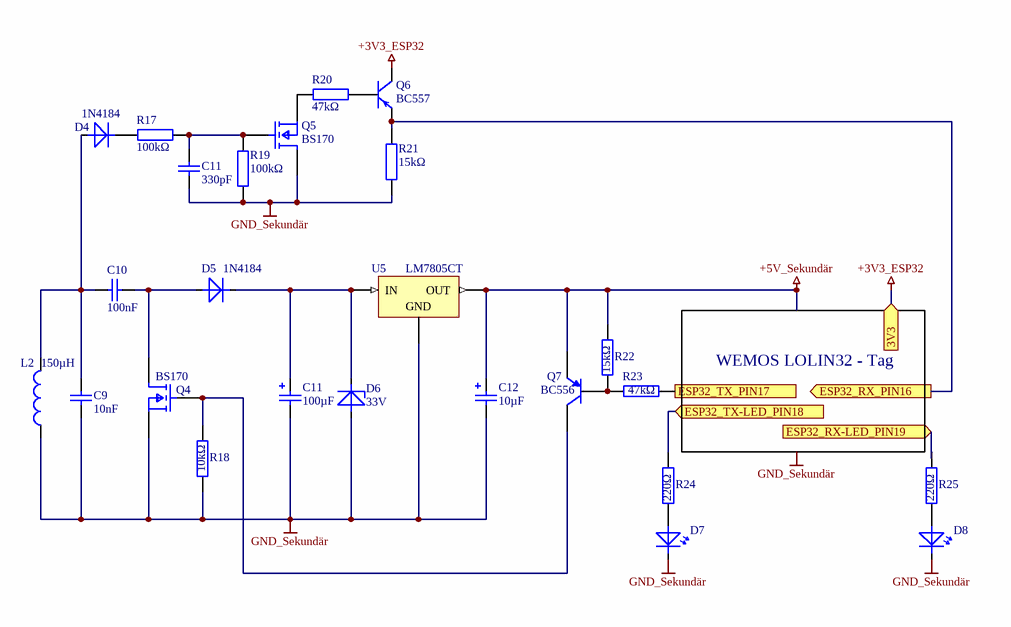
[diagram p9: Tag_Lastmodulation_ESP32.SchDoc]

### Parts
(Parts that share a designator on the sheet are numbered #1, #2 ... from top to bottom, then left to right.)
C9#4  value 10nF  [rad-7.2/2.5/5]  (hidden comment: KO)
C10#3  value 100nF  [rad-7.2/2.5/5]  (hidden comment: KO)
C11#4  value 330pF  [rad-7.2/2.5/5]  (hidden comment: KO)
C11#5  value 100µF  [RB-.1/.2]  (hidden comment: ELKO)
C12#3  value 10µF  [RB-.1/.2]  (hidden comment: ELKO)
D4#2  1N4184  [DIODE-0.6]
D5  1N4184  [DIODE-0.6]
D6  33V  [DIODE-0.4]
D7  LED  [LED-3]  (value not drawn)
D8  LED  [LED-3]  (value not drawn)
L2#4  value 150µH  (hidden comment: Inductor)
Q4#3  BS170  [FP-SOT23-IPC_A]
Q5#3  BS170  [FP-SOT23-IPC_A]
Q6#2  BC557  [TO-92/EBC]
Q7  BC556  [TO-92/EBC]
R17#2  value 100kΩ  [Axial-0.4]  (hidden comment: RES)
R18#2  value 10kΩ  [Axial-0.4]  (hidden comment: RES)
R19  value 100kΩ  [Axial-0.4]  (hidden comment: RES)
R20  value 47kΩ  [Axial-0.4]  (hidden comment: RES)
R21  value 15kΩ  [Axial-0.4]  (hidden comment: RES)
R22  value 15kΩ  [Axial-0.4]  (hidden comment: RES)
R23  value 47kΩ  [Axial-0.4]  (hidden comment: RES)
R24  value 220Ω  [Axial-0.4]  (hidden comment: RES)
R25  value 220Ω  [Axial-0.4]  (hidden comment: RES)
U5  LM7805CT  [FAIR-TO-220-3]

### Ports
3V3 (in), ESP32_RX-LED_PIN19 (in, see Lesegerät_Lastmodulation_ESP32[2C]), ESP32_RX_PIN16 (out, see Lesegerät_Lastmodulation_ESP32[2C]), ESP32_TX-LED_PIN18 (in, see Lesegerät_Lastmodulation_ESP32[2C]), ESP32_TX_PIN17 (in, see Lesegerät_Lastmodulation_ESP32[2C])

### Nets
+3V3_ESP32: Q6#2.3(C) ; port 3V3
+5V_Sekundär: C12#3.1 Q7.3(E) R22.2 U5.3(OUT)
GND_Sekundär: C9#4.1 C11#4.2 C11#5.2 C12#3.2 D6.1(A) D7.2(K) D8.2(K) L2#4.2 Q4#3.2(S) Q5#3.3(D) R18#2.1 R19.2 R21.2 U5.2(GND)
NetC9#4_2: C9#4.2 C10#3.2 D4#2.1(A) L2#4.1
NetC10#3_1: C10#3.1 D5.1(A) Q4#3.3(D)
NetC11#4_1: C11#4.1 Q5#3.G1(G) R17#2.1 R19.1
NetC11#5_1: C11#5.1 D5.2(K) D6.2(K) U5.1(IN)
NetD4#2_2: D4#2.2(K) R17#2.2
NetD7_1: D7.1(A) R24.1
NetD8_1: D8.1(A) R25.1
NetQ1#5_2: R23.1 ; port ESP32_TX_PIN17
NetQ4#3_G1: Q4#3.G1(G) Q7.1(C) R18#2.2
NetQ5#3_2: Q5#3.2(S) R20.2
NetQ6#2_1: Q6#2.1(B) R20.1
NetQ6#2_2: Q6#2.2(E) R21.1 ; port ESP32_RX_PIN16
NetQ7_2: Q7.2(B) R22.1 R23.2
NetR15#2_2: R25.2 ; port ESP32_RX-LED_PIN19
NetR16#2_2: R24.2 ; port ESP32_TX-LED_PIN18

### Notes on the sheet
- WEMOS LOLIN32 - Tag
- Labels drawn without touching a wire or pin: GND_Sekundär

### Library data of the parts
C9#4 C10#3 C11#4 = KO: Kondensator
D4#2 D5 = DIODE
D6 = Z-DIODE
D7 D8 = LED: Diode
L2#4 = Inductor: SimulationGenericComponent: True
Q4#3 Q5#3 = CMP-12801-000064-2: as Q2#1 on sheet Lesegerät; Weight: 0.000282oz; Height: 1mm; Max Operating Temperature: 150°C; Dual Supply Voltage: 60V; Termination: SMD/SMT; Number of Pins: 3; Number of Elements: 1; Mount: Surface Mount; Min Operating Temperature: -55°C; Nominal Vgs: 3V; Width: 1.4mm; Drain to Source Breakdown Voltage: 60V; Turn-Off Delay Time: 10ns; Case/Package: SOT-23; REACH SVHC: No SVHC; Packaging: Tape and Reel; Length: 3.05mm; Max Power Dissipation: 330mW; Rds On Max: 5R; Lead Free: Lead Free; Contact Plating: Tin; Drain to Source Resistance: 5R; Drain to Source Voltage (Vdss): 60V; Package Quantity: 3000; Current Rating: 150mA; Voltage Rating (DC): 60V
Q6#2 = PNP: Transistor
Q7 = BC556B: Amplifier Transistor PNP Silicon; pin to pad: 1>3 2>1 3>2; Published: 29-Sep-2000; LatestRevisionDate: 17-Jul-2002; LatestRevisionNote: Re-released for DXP Platform.; DatasheetVersion: 1991; PackageVersion: 1996; PackageReference: 29-04; Publisher: Altium Limited; PackageDescription: TO, Flat Index; 3 In-Line, Axial Leads; Body Dia. 4.8mm; Leads 0.48 x 0.5 mm (max); ComponentLink1Description: Manufacturer Link; ComponentLink1URL: http://www.onsemi.com/site/products/landing?taxonomyID=194; ComponentLink2Description: Datasheet; ComponentLink2URL: http://www.onsemi.com/pub/Collateral/BC556B-D.PDF
R17#2 R18#2 R19-R25 = RES: Widerstand
U5 = CMP-2000-04938-1: as U4#1 on sheet Tag; Category: LinearRegulator; Package Description: 3-Pin Through Hole Device, Body 10 x 4.5 mm, Pitch 2.54 mm; Packaging: Rail/Tube; Mounting: ThroughHole; Polarity: Positive; Manufacturer URL: https://www.fairchildsemi.com/; Line Regulation: 100mV; Datasheet Version: Aug-12; Datasheet URL: https://datasheet.ciiva.com/26904/lm7805ct-26904988.pdf; Package Reference: TO-220; Package URL: https://www.fairchildsemi.com/package-drawings/TO/TO220B03.pdf; Package: 3TO-220AB; Operating Temperature: -40to125degC; Type: Linear

## Nets that join several sheets
12V: Lesegerät (10 pins), Lesegerät_RC-Ozillator (CStütz1#2.2 R1#2.2 R2#2.2 U1#2.8), Lesegerät_SigA_MosT_GegE (6 pins), Lesegerät_Lastmodulation_Sekundär (11 pins), Lesegerät_Lastmodulation_Primär (12 pins), Lesegerät_Lastmodulation_ESP32 (14 pins)
+5V_Sekundär: Tag_Lastmodulation_Primär (C12#2.1 Q6#1.3 R18#1.2 U4#3.3), Tag_Lastmodulation_ESP32 (C12#3.1 Q7.3 R22.2 U5.3)
GND: Lesegerät (12 pins), Lesegerät_RC-Ozillator (C1#2.2 CStütz1#2.1 U1#2.1), Lesegerät_SigA_MosT_GegE (9 pins), Lesegerät_Lastmodulation_Sekundär (16 pins), Lesegerät_Lastmodulation_Primär (18 pins), Lesegerät_Lastmodulation_ESP32 (23 pins)
GND_Sekundär: Tag_Lastmodulation_Primär (13 pins), Tag_Lastmodulation_ESP32 (14 pins)
NetQ1#5_2: Lesegerät_Lastmodulation_ESP32 (Q1#5.2), Tag_Lastmodulation_ESP32 (R23.1)
NetQ6#2_2: Lesegerät_Lastmodulation_ESP32 (R13#2.1 R14#2.2), Tag_Lastmodulation_ESP32 (Q6#2.2 R21.1)
NetR3#2_1: Lesegerät_RC-Ozillator (R3#2.1 R3#2.3 U1#2.3), Lesegerät_SigA_MosT_GegE (R4#2.1 U2#2.1 U3#2.3)
NetR15#2_2: Lesegerät_Lastmodulation_ESP32 (R15#2.2), Tag_Lastmodulation_ESP32 (R25.2)
NetR16#2_2: Lesegerät_Lastmodulation_ESP32 (R16#2.2), Tag_Lastmodulation_ESP32 (R24.2)